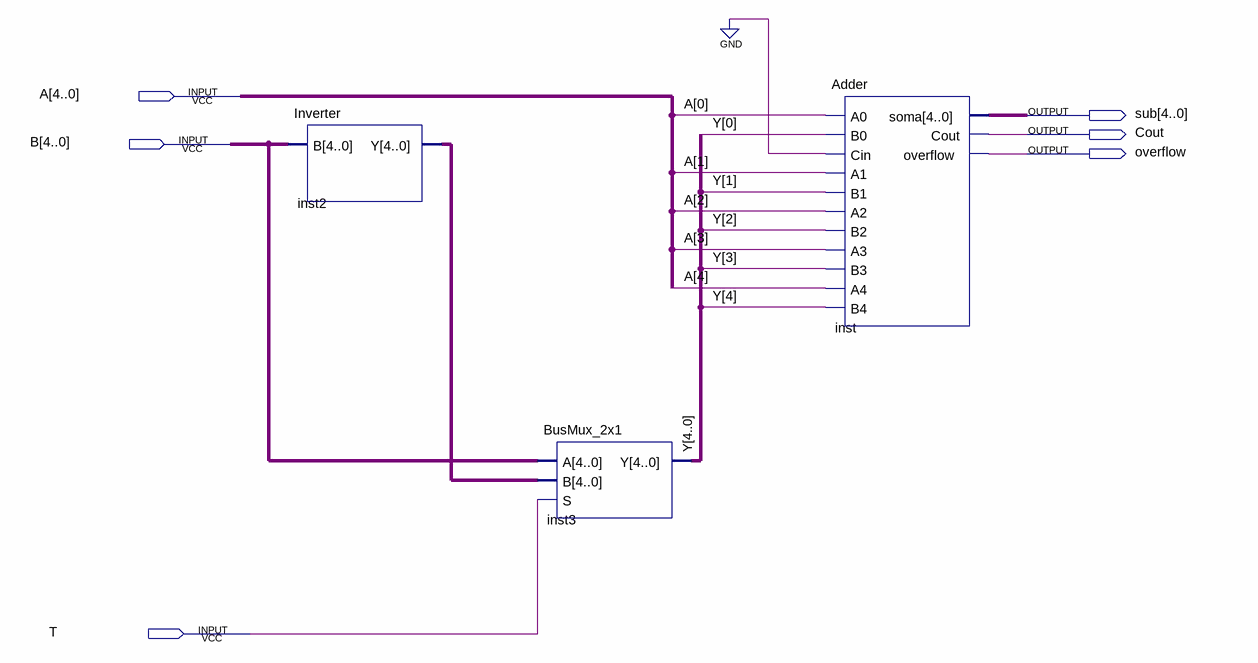
[diagram p0: schematic sheet]
// Quartus schematic SubAdder.bdf as structural Verilog: 3 symbols, 6 pins
module SubAdder (
  input  [4:0] A,
  input  [4:0] B,
  input  T,
  output [4:0] sub,
  output Cout,
  output overflow
);

  wire [4:0] inst2_y, Y;

  Inverter inst2 (.B(B), .Y(inst2_y));
  BusMux_2x1 inst3 (.A(B), .B(inst2_y), .S(T), .Y(Y));
  Adder inst (
    .A0(A[0]), .B0(Y[0]), .Cin(1'b0), .A1(A[1]), .B1(Y[1]), .A2(A[2]), .B2(Y[2]), .A3(A[3]), .B3(Y[3]),
    .A4(A[4]), .B4(Y[4]), .soma(sub), .Cout(Cout), .overflow(overflow));
endmodule
